# Altium project ClimaSens-Sensor.PrjPcb
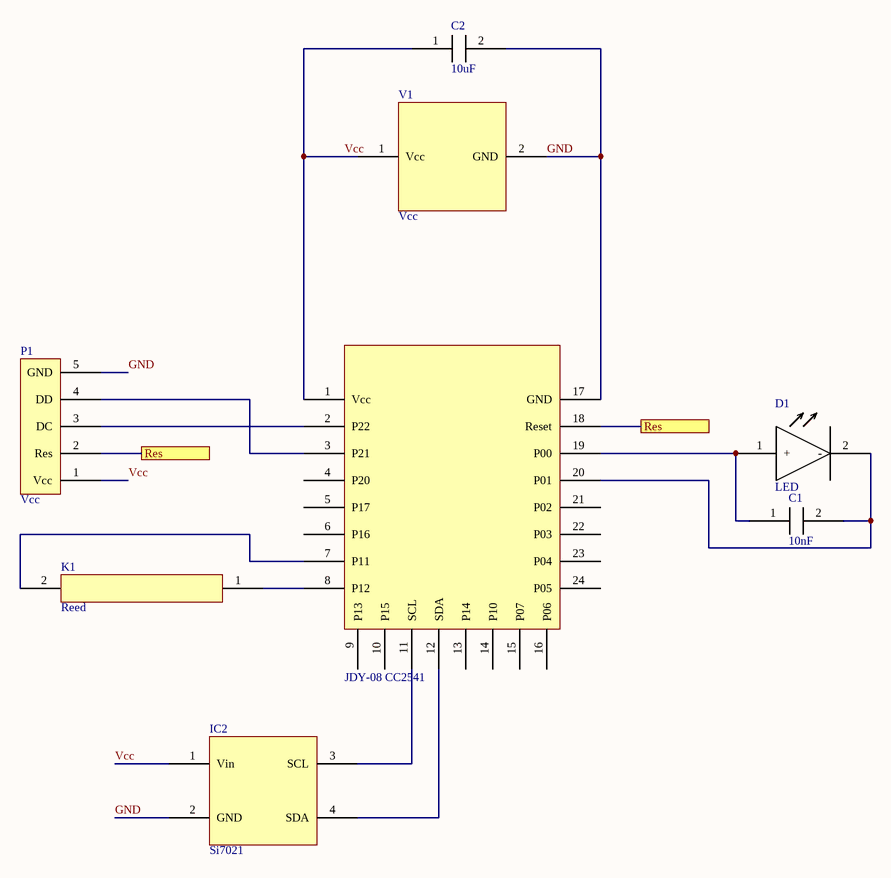
[diagram p0: ClimaSens-Sensor.SchDoc]
1 sheet, 8 parts. Net scope: flat (ports and power ports of the same name join across sheets).
Board file: ClimaSens-Sensor.PcbDoc

## Sheet ClimaSens-Sensor.SchDoc
size A4

### Parts
C1  10nF  [0805]
C2  10uF  [0805]
D1  LED  [LED 3mm]
IC2  Si7021  [Si7021]
K1  Reed  [Reed]
P1  Vcc  [ProgramPort]
V1  Vcc  [Battery-Clip]
  JDY-08 CC2541  [JDY-08 CC2541]

### Ports
Res

### Nets
GND: C2.2 IC2.2(GND) P1.5(GND) V1.2(GND) .17(GND)
Vcc: C2.1 IC2.1(Vin) P1.1(Vcc) V1.1(Vcc) .1(Vcc)
NetC1_1: C1.1 D1.1(+) .19(P00)
NetC1_2: C1.2 D1.2(-) .20(P01)
NetIC2_3: IC2.3(SCL) .11(SCL)
NetIC2_4: IC2.4(SDA) .12(SDA)
NetK1_1: K1.1 .8(P12)
NetK1_2: K1.2 .7(P11)
NetP1_2: P1.2(Res) .18(Reset) ; port Res
NetP1_3: P1.3(DC) .2(P22)
NetP1_4: P1.4(DD) .3(P21)

Not connected (* = marked no-connect by the designer):  4(P20) 5(P17) 6(P16) 9(P13) 10(P15) 13(P14) 14(P10) 15(P07) 16(P06) 21(P02) 22(P03) 23(P04) 24(P05)

### Library data of the parts
C1 C2 = Capacitator
P1 = ProgramPort
V1 = Battery Clip